# Altium project ATS Controller.PrjPCB
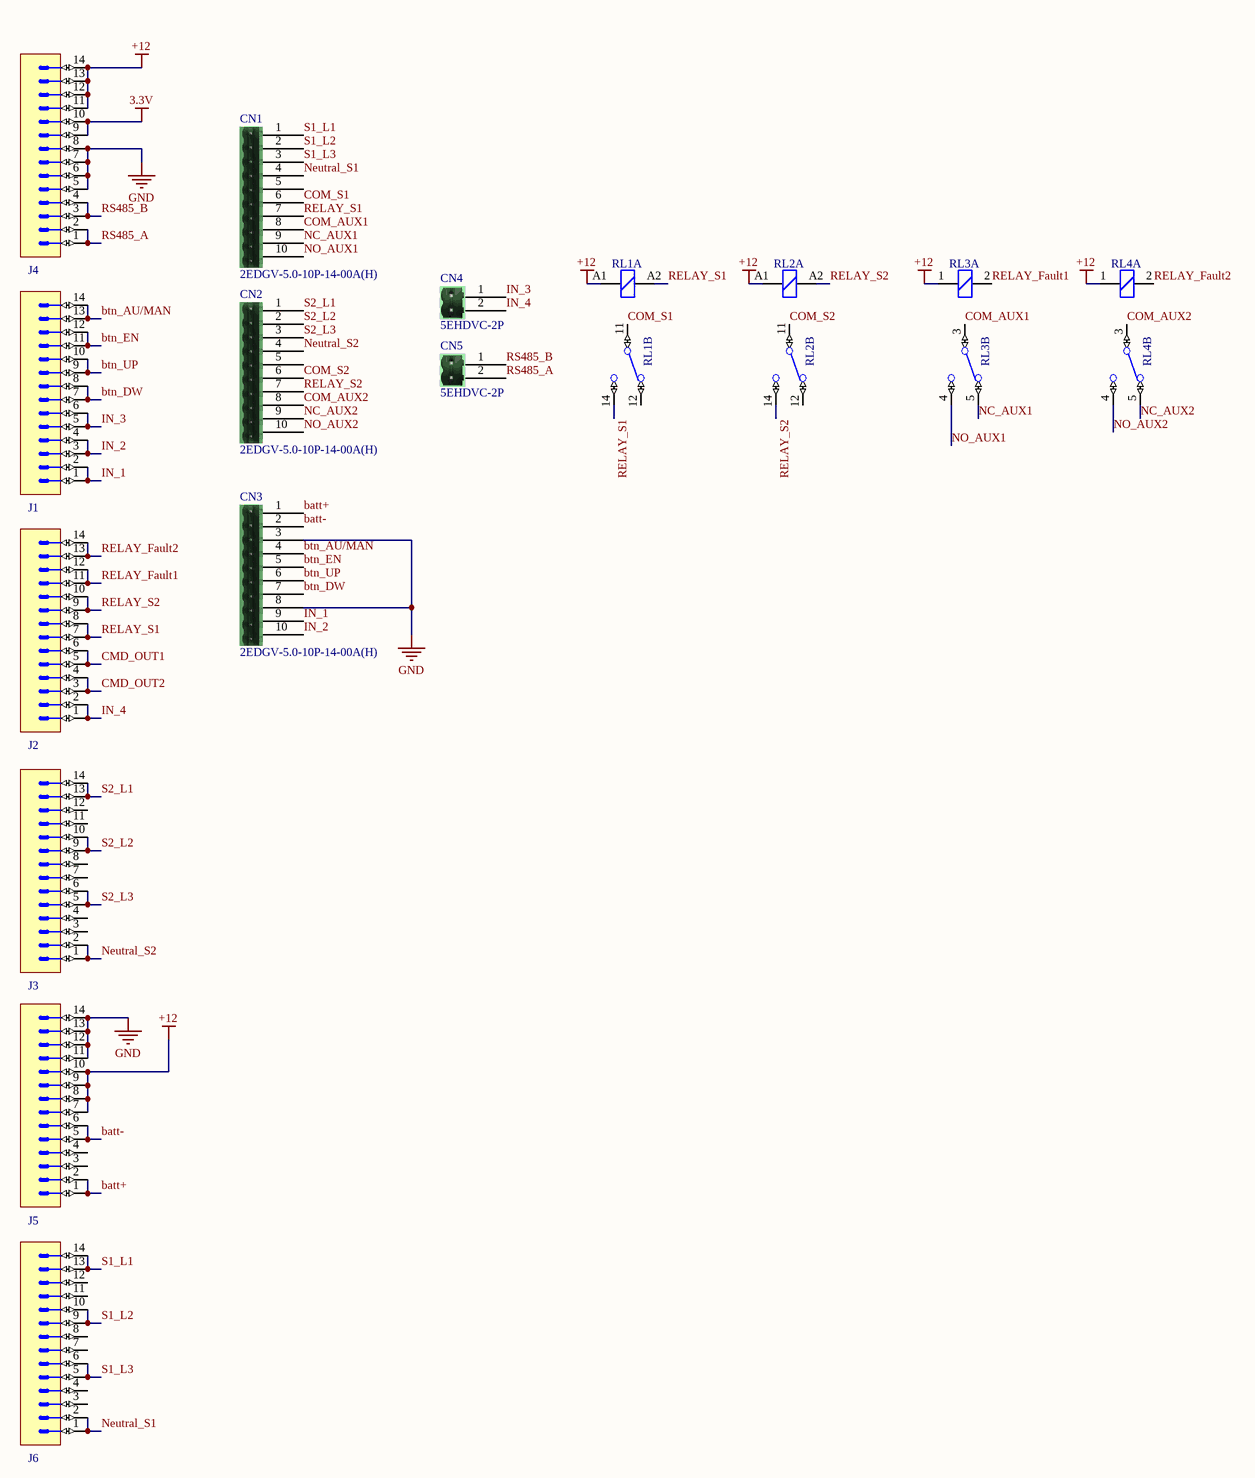
[diagram p0: Back_Board.SchDoc]
1 sheet, 15 parts. Net scope: global (net labels, ports and power ports of the same name join across sheets).
Board files: BACK.PcbDoc, PCB1.PcbDoc, Lower1.2.PcbDoc, UpperV1.2.PcbDoc, Front.PcbDoc, BACK1.1.PcbDoc

## Sheet Back_Board.SchDoc
size A3

### Parts
CN1  2EDGV-5.0-10P-14-00A(H)  [0330-0097-8_2EDGV-5.0-10P-14-00A(H)]
CN2  2EDGV-5.0-10P-14-00A(H)  [0330-0097-8_2EDGV-5.0-10P-14-00A(H)]
CN3  2EDGV-5.0-10P-14-00A(H)  [0330-0097-8_2EDGV-5.0-10P-14-00A(H)]
CN4  5EHDVC-2P  [0005-0113-3_5EHDVC-2P]
CN5  5EHDVC-2P  [0005-0113-3_5EHDVC-2P]
J1  Header 14  [COMATEL_389.0358.1.14.400]  (value not drawn)
J2  Header 14  [COMATEL_389.0358.1.14.400]  (value not drawn)
J3  Header 14  [COMATEL_389.0358.1.14.400]  (value not drawn)
J4  Header 14  [COMATEL_389.0358.1.14.400]  (value not drawn)
J5  Header 14  [COMATEL_389.0358.1.14.400]  (value not drawn)
J6  Header 14  [COMATEL_389.0358.1.14.400]  (value not drawn)
RL1  12VDC  [REL_TYCO_SCHRACK_RT31XXXX]  (value not drawn)  (parts A,B of 2)
RL2  12VDC  [REL_TYCO_SCHRACK_RT31XXXX]  (value not drawn)  (parts A,B of 2)
RL3  5VDC  [REL_FINDER_36.11]  (value not drawn)  (parts A,B of 2)
RL4  5VDC  [REL_FINDER_36.11]  (value not drawn)  (parts A,B of 2)

### Nets
3.3V: J4.9 J4.10
+12: J4.11 J4.12 J4.13 J4.14 J5.7 J5.8 J5.9 J5.10 RL1.A1 RL2.A1 RL3.1(COIL) RL4.1(COIL)
GND: CN3.3 CN3.8 J4.5 J4.6 J4.7 J4.8 J5.11 J5.12 J5.13 J5.14
batt+: CN3.1 J5.1 J5.2
batt-: CN3.2 J5.5 J5.6
btn_AU/MAN: CN3.4 J1.13 J1.14
btn_DW: CN3.7 J1.7 J1.8
btn_EN: CN3.5 J1.11 J1.12
btn_UP: CN3.6 J1.9 J1.10
CMD_OUT1: J2.5 J2.6
CMD_OUT2: J2.3 J2.4
COM_AUX1: CN1.8 RL3.3(C)
COM_AUX2: CN2.8 RL4.3(C)
COM_S1: CN1.6 RL1.11(C)
COM_S2: CN2.6 RL2.11(C)
IN_1: CN3.9 J1.1 J1.2
IN_2: CN3.10 J1.3 J1.4
IN_3: CN4.1 J1.5 J1.6
IN_4: CN4.2 J2.1 J2.2
NC_AUX1: CN1.9 RL3.5(NC)
NC_AUX2: CN2.9 RL4.5(NC)
Neutral_S1: CN1.4 J6.1 J6.2
Neutral_S2: CN2.4 J3.1 J3.2
NO_AUX1: CN1.10 RL3.4(NO)
NO_AUX2: CN2.10 RL4.4(NO)
RELAY_Fault1: J2.11 J2.12 RL3.2(COIL)
RELAY_Fault2: J2.13 J2.14 RL4.2(COIL)
RELAY_S1: CN1.7 J2.7 J2.8 RL1.14(NO) RL1.A2
RELAY_S2: CN2.7 J2.9 J2.10 RL2.14(NO) RL2.A2
RS485_A: CN5.2 J4.1 J4.2
RS485_B: CN5.1 J4.3 J4.4
S1_L1: CN1.1 J6.13 J6.14
S1_L2: CN1.2 J6.9 J6.10
S1_L3: CN1.3 J6.5 J6.6
S2_L1: CN2.1 J3.13 J3.14
S2_L2: CN2.2 J3.9 J3.10
S2_L3: CN2.3 J3.5 J3.6

Not connected (* = marked no-connect by the designer): CN1 5; CN2 5; J3 3 4 7 8 11 12; J5 3 4; J6 3 4 7 8 11 12; RL1 12(NC); RL2 12(NC)

### Library data of the parts
CN1-CN3 = 0330-0097-8_2EDGV-5.0-10P-14-00A(H): Plug-in Terminal Block 10pins,Male,300V/15A  Pitch 5.0mm; Manufacture: DEGSON; Supply: Electronics Source Co.,Ltd.; Drawing by: PCB Engineering; Part Number: 2EDGV-5.0-10P-14-00A(H); ES Part Number: 0330-0097-8
CN4 CN5 = 0005-0113-3_5EHDVC-2P: Plug-in Terminal Block 2pins,Male,300V/15A  Pitch 5.00mm; Manufacture: DINKLE; Supply: Electronics Source Co.,Ltd.; Drawing by: PCB Engineering; Part Number: 5EHDVC-2P; ES Part Number: 0005-0113-3
J1-J6 = COMATEL_389.0358.1.14.400: Connector 14 Male; Part Description: 14 Contacts - Pitch 2.54mm - Dual Row Straight Strip Header - Insulator 1.7mm; Manufacturer: KONTEK COMATEL; Table: STELVIO-KONTEK COMATEL; Part Number: COMATEL_389.0358.1.14.400; Component Kind: Standard; Component Type: Standard; Pin Count: 14; Family: Header 14; Mounted: Yes; Socket: No; SMD: No; Status: Obsolete; Manufacturer Part Number: 389.0358.1.14.400; ComponentHeight: 8mm; HelpURL: \\cern.ch\dfs\Applications\Altium\Datasheets\COMATEL_389.0358.1.14.400.pdf; Author: CERN DEM JLC; CreateDate: 10/4/2551; LatestRevisionDate: 10/4/2551
RL1 RL2 = REL_TYCO_SCHRACK_RT314012: RT PCB Relay Form C (1 CO Contact); Part Description: 16A SPDT Power PCB Relay, RT1 Serie; Manufacturer: TYCO SCHRACK; Manufacturer Part Number: RT314012 or 9-1393239-5; Table: Relays; Part Number: REL_TYCO_SCHRACK_RT314012; Component Kind: Standard; Component Type: Standard; Pin Count: 8; PackageDescription: 8 Leads, Row Spacing 7.62 mm; Body 29mm x 12.7mm, TYCO RT Serie; Mounted: Yes; Socket: No; SMD: No; Status: None; Value: 12VDC; ComponentHeight: 15.7mm; HelpURL: \\cern.ch\dfs\Applications\Altium\Datasheets\REL_TYCO_SCHRACK_RT314012.pdf; Author: CERN DEM JLC; CreateDate: 15/2/2554; LatestRevisionDate: 15/2/2554
RL3 RL4 = REL_FINDER_36.11.9.005.4001: 10A SPDT PCB Relay, 36 Serie; Part Description: 10A SPDT Miniature PCB Relay, 36 Serie; Manufacturer: FINDER; Table: Relays; Part Number: REL_FINDER_36.11.9.005.4001; Component Kind: Standard; Component Type: Standard; Pin Count: 5; PackageDescription: 5 Leads Relay, Row Spacing 12 mm; Body 19mm x 15.5mm, 36 Serie; Mounted: Yes; Socket: No; SMD: No; Status: None; Value: 5VDC; Manufacturer Part Number: 36.11.9.005.4001; ComponentHeight: 15.5mm; HelpURL: \\cern.ch\dfs\Applications\Altium\Datasheets\REL_FINDER_36.11.pdf; Author: CERN DEM JLC; CreateDate: 4/2/2556; LatestRevisionDate: 4/2/2556